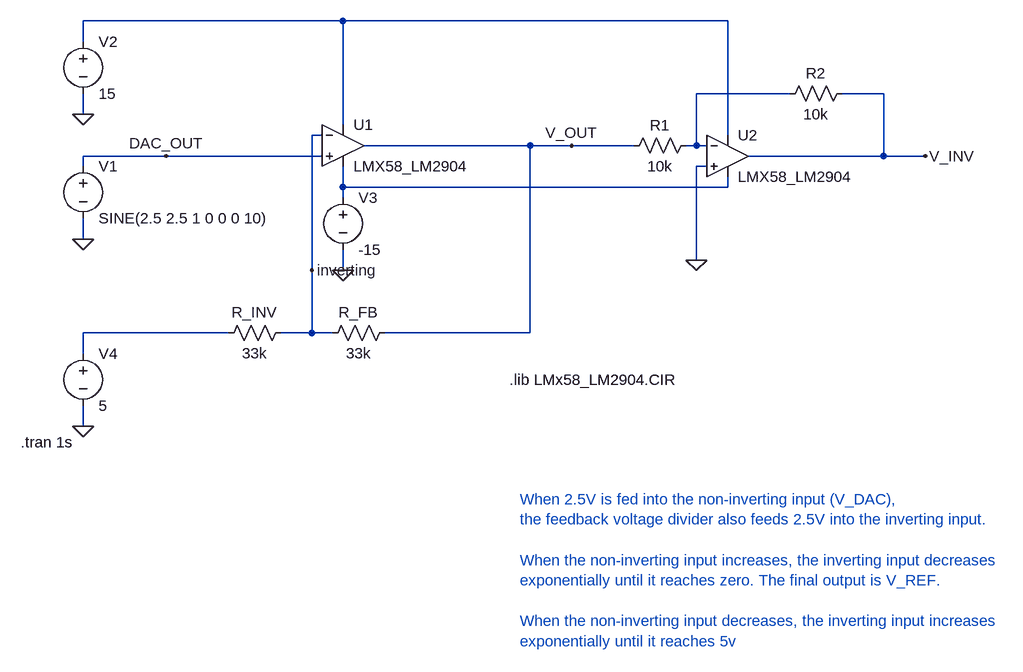
[diagram p0: schematic Bipolar Amplifier.asc]
Bipolar Amplifier.asc, the LTspice schematic file:
Version 4
SHEET 1 2436 932
WIRE 480 -16 80 -16
WIRE 1072 -16 480 -16
WIRE 80 16 80 -16
WIRE 1168 96 1024 96
WIRE 1312 96 1248 96
WIRE 80 128 80 96
WIRE 480 144 480 -16
WIRE 448 160 432 160
WIRE 1072 160 1072 -16
WIRE 768 176 512 176
WIRE 832 176 768 176
WIRE 928 176 832 176
WIRE 1024 176 1024 96
WIRE 1024 176 1008 176
WIRE 1040 176 1024 176
WIRE 208 192 80 192
WIRE 448 192 208 192
WIRE 1312 192 1312 96
WIRE 1312 192 1104 192
WIRE 1376 192 1312 192
WIRE 80 208 80 192
WIRE 1040 208 1024 208
WIRE 480 240 480 208
WIRE 1072 240 1072 224
WIRE 1072 240 480 240
WIRE 480 256 480 240
WIRE 80 320 80 288
WIRE 1024 352 1024 208
WIRE 432 368 432 160
WIRE 480 368 480 336
WIRE 304 464 80 464
WIRE 432 464 432 368
WIRE 432 464 384 464
WIRE 464 464 432 464
WIRE 768 464 768 176
WIRE 768 464 544 464
WIRE 80 496 80 464
WIRE 80 608 80 576
FLAG 480 368 0
FLAG 80 128 0
FLAG 80 320 0
FLAG 80 608 0
FLAG 832 176 V_OUT
FLAG 208 192 DAC_OUT
FLAG 432 368 inverting
FLAG 1024 352 0
FLAG 1376 192 V_INV
SYMBOL voltage 80 192 R0
WINDOW 123 0 0 Left 0
WINDOW 39 0 0 Left 0
SYMATTR InstName V1
SYMATTR Value SINE(2.5 2.5 1 0 0 0 10)
SYMBOL voltage 80 0 R0
WINDOW 123 0 0 Left 0
WINDOW 39 0 0 Left 0
SYMATTR InstName V2
SYMATTR Value 15
SYMBOL voltage 480 240 R0
WINDOW 123 0 0 Left 0
WINDOW 39 0 0 Left 0
SYMATTR InstName V3
SYMATTR Value -15
SYMBOL res 400 448 R90
WINDOW 0 0 56 VBottom 2
WINDOW 3 32 56 VTop 2
SYMATTR InstName R_INV
SYMATTR Value 33k
SYMBOL res 560 448 R90
WINDOW 0 0 56 VBottom 2
WINDOW 3 32 56 VTop 2
SYMATTR InstName R_FB
SYMATTR Value 33k
SYMBOL Opamps\\opamp2 480 112 R0
SYMATTR InstName U1
SYMATTR Value LMX58_LM2904
SYMBOL voltage 80 480 R0
WINDOW 123 0 0 Left 0
WINDOW 39 0 0 Left 0
SYMATTR InstName V4
SYMATTR Value 5
SYMBOL Opamps\\opamp2 1072 128 R0
SYMATTR InstName U2
SYMATTR Value LMX58_LM2904
SYMBOL res 1024 160 R90
WINDOW 0 0 56 VBottom 2
WINDOW 3 32 56 VTop 2
SYMATTR InstName R1
SYMATTR Value 10k
SYMBOL res 1264 80 R90
WINDOW 0 0 56 VBottom 2
WINDOW 3 32 56 VTop 2
SYMATTR InstName R2
SYMATTR Value 10k
TEXT -16 632 Left 2 !.tran 1s
TEXT 736 536 Left 2 !.lib LMx58_LM2904.CIR
TEXT 752 720 Left 2 ;When 2.5V is fed into the non-inverting input (V_DAC),\nthe feedback voltage divider also feeds 2.5V into the inverting input.\n \nWhen the non-inverting input increases, the inverting input decreases\nexponentially until it reaches zero. The final output is V_REF.\n \nWhen the non-inverting input decreases, the inverting input increases\nexponentially until it reaches 5v

The netlist it stands for:
* Bipolar Amplifier.asc
V1 DAC_OUT 0 SINE(2.5 2.5 1 0 0 0 10)
V2 N001 0 15
V3 N003 0 -15
R_INV inverting N004 33k
R_FB V_OUT inverting 33k
XU1 DAC_OUT inverting N001 N003 V_OUT LMX58_LM2904  ; pins In+ In- V+ V- OUT
V4 N004 0 5
XU2 0 N002 N001 N003 V_INV LMX58_LM2904  ; pins In+ In- V+ V- OUT
R1 N002 V_OUT 10k
R2 V_INV N002 10k
.tran 1s
.lib LMx58_LM2904.CIR
* When 2.5V is fed into the non-inverting input (V_DAC),
* the feedback voltage divider also feeds 2.5V into the inverting input.
* When the non-inverting input increases, the inverting input decreases
* exponentially until it reaches zero. The final output is V_REF.
* When the non-inverting input decreases, the inverting input increases
* exponentially until it reaches 5v
.backanno
.end